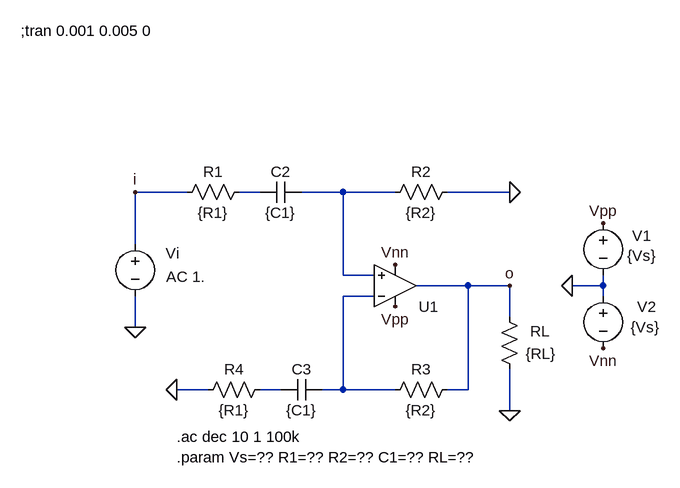
[diagram p0: schematic Filter05Fig.asc]
Filter05Fig.asc, the LTspice schematic file:
Version 4
SHEET 1 968 680
WIRE -176 80 -256 80
WIRE -64 80 -96 80
WIRE 64 80 0 80
WIRE 144 80 64 80
WIRE 320 80 224 80
WIRE -256 160 -256 80
WIRE 64 208 64 80
WIRE 112 208 64 208
WIRE 256 224 176 224
WIRE 320 224 256 224
WIRE 464 224 464 208
WIRE 464 224 416 224
WIRE 112 240 64 240
WIRE 464 240 464 224
WIRE 320 272 320 224
WIRE -256 288 -256 240
WIRE -144 384 -192 384
WIRE -32 384 -64 384
WIRE 64 384 64 240
WIRE 64 384 32 384
WIRE 144 384 64 384
WIRE 256 384 256 224
WIRE 256 384 224 384
WIRE 320 416 320 352
FLAG 464 128 Vpp
FLAG 416 224 0
FLAG 464 320 Vnn
FLAG 320 416 0
FLAG -256 288 0
FLAG 144 256 Vpp
FLAG 144 192 Vnn
FLAG 320 224 o
FLAG -256 80 i
FLAG 320 80 0
FLAG -192 384 0
SYMBOL voltage 464 112 R0
WINDOW 123 0 0 Left 0
WINDOW 39 0 0 Left 0
WINDOW 0 45 35 Left 2
WINDOW 3 37 66 Left 2
SYMATTR InstName V1
SYMATTR Value {Vs}
SYMBOL voltage 464 224 R0
WINDOW 123 0 0 Left 0
WINDOW 39 0 0 Left 0
WINDOW 0 52 32 Left 2
WINDOW 3 42 64 Left 2
SYMATTR InstName V2
SYMATTR Value {Vs}
SYMBOL res 304 256 R0
WINDOW 0 48 38 Left 2
WINDOW 3 41 73 Left 2
SYMATTR InstName RL
SYMATTR Value {RL}
SYMBOL voltage -256 144 R0
WINDOW 3 48 66 Left 2
WINDOW 123 0 0 Left 0
WINDOW 39 0 0 Left 0
WINDOW 0 47 30 Left 2
SYMATTR Value AC 1.
SYMATTR InstName Vi
SYMBOL Opamps\\UniversalOpamp2 144 224 M180
WINDOW 0 36 -32 Left 2
SYMATTR InstName U1
SYMBOL cap 0 64 R90
WINDOW 0 0 32 VBottom 2
WINDOW 3 32 32 VTop 2
SYMATTR InstName C2
SYMATTR Value {C1}
SYMBOL res -80 64 R90
WINDOW 0 0 56 VBottom 2
WINDOW 3 32 56 VTop 2
SYMATTR InstName R1
SYMATTR Value {R1}
SYMBOL res 240 64 R90
WINDOW 0 0 56 VBottom 2
WINDOW 3 32 56 VTop 2
SYMATTR InstName R2
SYMATTR Value {R2}
SYMBOL res 128 400 R270
WINDOW 0 32 56 VTop 2
WINDOW 3 0 56 VBottom 2
SYMATTR InstName R3
SYMATTR Value {R2}
SYMBOL cap -32 400 R270
WINDOW 0 32 32 VTop 2
WINDOW 3 0 32 VBottom 2
SYMATTR InstName C3
SYMATTR Value {C1}
SYMBOL res -160 400 R270
WINDOW 0 32 56 VTop 2
WINDOW 3 0 56 VBottom 2
SYMATTR InstName R4
SYMATTR Value {R1}
TEXT -192 488 Left 2 !.param Vs=?? R1=?? R2=?? C1=?? RL=??
TEXT -432 -168 Left 2 !;tran 0.001 0.005 0
TEXT -192 456 Left 2 !.ac dec 10 1 100k

The netlist it stands for:
* Filter05Fig.asc
V1 Vpp 0 {Vs}
V2 0 Vnn {Vs}
RL o 0 {RL}
Vi i 0 AC 1.
XU1 N002 N003 Vpp Vnn o level.2 Avol=1Meg GBW=10Meg Slew=10Meg ilimit=25m rail=0 Vos=0 phimargin=45 en=0 enk=0 in=0 ink=0 Rin=500Meg  ; pins IN+ IN- V+ V- OUT
C2 N002 N001 {C1}
R1 N001 i {R1}
R2 0 N002 {R2}
R3 N003 o {R2}
C3 N004 N003 {C1}
R4 0 N004 {R1}
.param Vs=?? R1=?? R2=?? C1=?? RL=??
;tran 0.001 0.005 0
.ac dec 10 1 100k
.lib UniversalOpamps2.sub
.backanno
.end